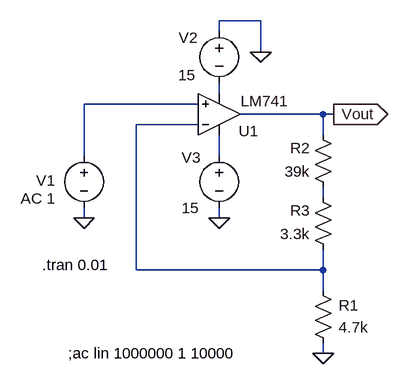
[diagram p0: schematic lab5_2.asc]
lab5_2.asc, the LTspice schematic file:
Version 4
SHEET 1 880 680
WIRE 240 32 176 32
WIRE 176 48 176 32
WIRE 240 80 240 32
WIRE 176 144 176 128
WIRE 144 160 -32 160
WIRE 336 176 208 176
WIRE 352 176 336 176
WIRE 144 192 48 192
WIRE 336 208 336 176
WIRE -32 240 -32 160
WIRE 176 240 176 208
WIRE 336 304 336 288
WIRE -32 336 -32 320
WIRE 176 336 176 320
WIRE 48 416 48 192
WIRE 336 416 336 384
WIRE 336 416 48 416
WIRE 336 448 336 416
WIRE 336 544 336 528
FLAG 240 80 0
FLAG 176 336 0
FLAG 352 176 Vout
IOPIN 352 176 Out
FLAG -32 336 0
FLAG 336 544 0
SYMBOL OpAmps\\LM741 176 240 M180
WINDOW 0 30 38 Left 2
WINDOW 3 33 84 Left 2
SYMATTR InstName U1
SYMBOL voltage -32 224 R0
WINDOW 3 24 96 Invisible 2
WINDOW 123 -44 82 Right 2
WINDOW 39 0 0 Left 0
WINDOW 0 -44 54 Right 2
SYMATTR Value SINE(0 1 100 1e-6 1e-3 1e-3)
SYMATTR Value2 AC 1
SYMATTR InstName V1
SYMBOL voltage 176 32 R0
WINDOW 0 -62 26 Left 2
WINDOW 3 -63 84 Left 2
WINDOW 123 0 0 Left 0
WINDOW 39 0 0 Left 0
SYMATTR InstName V2
SYMATTR Value 15
SYMBOL voltage 176 224 R0
WINDOW 0 -58 19 Left 2
WINDOW 3 -58 96 Left 2
WINDOW 123 0 0 Left 0
WINDOW 39 0 0 Left 0
SYMATTR InstName V3
SYMATTR Value 15
SYMBOL res 352 544 R180
WINDOW 0 -39 74 Left 2
WINDOW 3 -54 40 Left 2
SYMATTR InstName R1
SYMATTR Value 4.7k
SYMBOL res 352 304 R180
WINDOW 0 36 76 Left 2
WINDOW 3 36 40 Left 2
SYMATTR InstName R2
SYMATTR Value 39k
SYMBOL res 352 400 R180
WINDOW 0 36 76 Left 2
WINDOW 3 36 40 Left 2
SYMATTR InstName R3
SYMATTR Value 3.3k
TEXT -96 408 Left 2 !.tran 0.01
TEXT -56 544 Left 2 !;ac lin 1000000 1 10000

The netlist it stands for:
* lab5_2.asc
XU1 N002 N003 N004 N001 Vout LM741  ; pins In+ In- V+ V- OUT
V1 N002 0 SINE(0 1 100 1e-6 1e-3 1e-3) AC 1
V2 0 N001 15
V3 N004 0 15
R1 0 N003 4.7k
R2 N005 Vout 39k
R3 N003 N005 3.3k
.tran 0.01
;ac lin 1000000 1 10000
.lib LM741.lib
.backanno
.end